# EAGLE design Board (EAGLE 6.1)
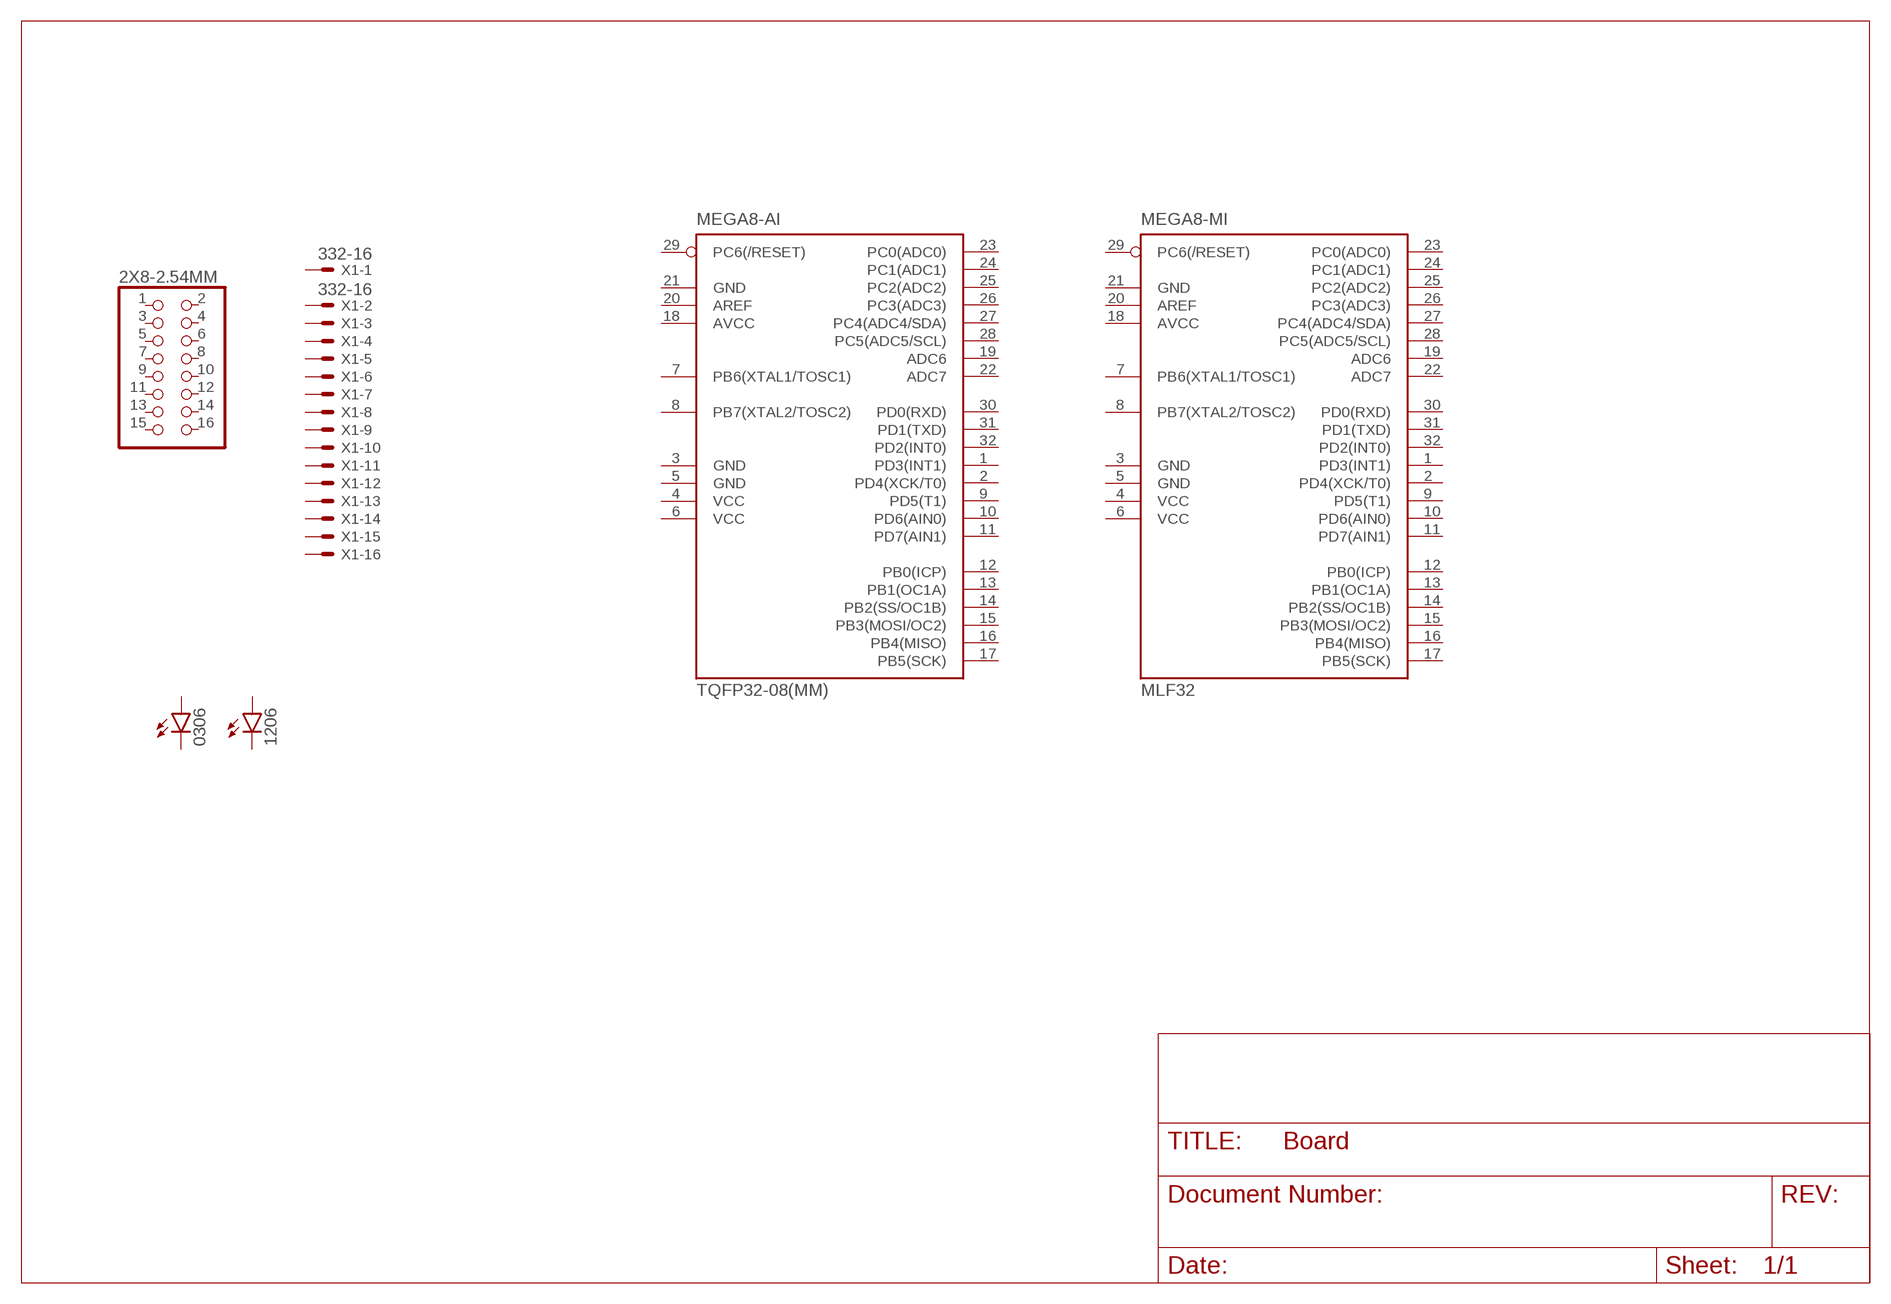
[diagram p0: schematic, sheet 1]

## Parts
2X8-2.54MM  PINHD-2X8  [2X08]
0306  LED0603  [LED-0603]
1206  LED1206  [LED-1206]
MLF32  MEGA8-MI  [MLF32]
TQFP32-08(MM)  MEGA8-AI  [TQFP32-08]
X1  332-16  [332-16]
Unconnected: 2X8-2.54MM.1 2X8-2.54MM.2 2X8-2.54MM.3 2X8-2.54MM.4 2X8-2.54MM.5 2X8-2.54MM.6 2X8-2.54MM.7 2X8-2.54MM.8 2X8-2.54MM.9 2X8-2.54MM.10 2X8-2.54MM.11 2X8-2.54MM.12 2X8-2.54MM.13 2X8-2.54MM.14 2X8-2.54MM.15 2X8-2.54MM.16 0306.A 0306.C 1206.A 1206.C MLF32.1(PD3(INT1)) MLF32.2(PD4(XCK/T0)) MLF32.7(PB6(XTAL1/TOSC1)) MLF32.8(PB7(XTAL2/TOSC2)) MLF32.9(PD5(T1)) MLF32.10(PD6(AIN0)) MLF32.11(PD7(AIN1)) MLF32.12(PB0(ICP)) MLF32.13(PB1(OC1A)) MLF32.14(PB2(SS/OC1B)) MLF32.15(PB3(MOSI/OC2)) MLF32.16(PB4(MISO)) MLF32.17(PB5(SCK)) MLF32.19(ADC6) MLF32.20(AREF) MLF32.22(ADC7) MLF32.23(PC0(ADC0)) MLF32.24(PC1(ADC1)) MLF32.25(PC2(ADC2)) MLF32.26(PC3(ADC3)) MLF32.27(PC4(ADC4/SDA)) MLF32.28(PC5(ADC5/SCL)) MLF32.29(PC6(/RESET)) MLF32.30(PD0(RXD)) MLF32.31(PD1(TXD)) MLF32.32(PD2(INT0)) TQFP32-08(MM).1(PD3(INT1)) TQFP32-08(MM).2(PD4(XCK/T0)) TQFP32-08(MM).7(PB6(XTAL1/TOSC1)) TQFP32-08(MM).8(PB7(XTAL2/TOSC2)) TQFP32-08(MM).9(PD5(T1)) TQFP32-08(MM).10(PD6(AIN0)) TQFP32-08(MM).11(PD7(AIN1)) TQFP32-08(MM).12(PB0(ICP)) TQFP32-08(MM).13(PB1(OC1A)) TQFP32-08(MM).14(PB2(SS/OC1B)) TQFP32-08(MM).15(PB3(MOSI/OC2)) TQFP32-08(MM).16(PB4(MISO)) TQFP32-08(MM).17(PB5(SCK)) TQFP32-08(MM).19(ADC6) TQFP32-08(MM).20(AREF) TQFP32-08(MM).22(ADC7) TQFP32-08(MM).23(PC0(ADC0)) TQFP32-08(MM).24(PC1(ADC1)) TQFP32-08(MM).25(PC2(ADC2)) TQFP32-08(MM).26(PC3(ADC3)) TQFP32-08(MM).27(PC4(ADC4/SDA)) TQFP32-08(MM).28(PC5(ADC5/SCL)) TQFP32-08(MM).29(PC6(/RESET)) TQFP32-08(MM).30(PD0(RXD)) TQFP32-08(MM).31(PD1(TXD)) TQFP32-08(MM).32(PD2(INT0)) X1.1 X1.2 X1.3 X1.4 X1.5 X1.6 X1.7 X1.8 X1.9 X1.10 X1.11 X1.12 X1.13 X1.14 X1.15 X1.16

## Power pins joined to a net without a drawn wire
AVCC: MLF32.18(AVCC) TQFP32-08(MM).18(AVCC)
GND: MLF32.3(GND) MLF32.5(GND) MLF32.21(GND) TQFP32-08(MM).3(GND) TQFP32-08(MM).5(GND) TQFP32-08(MM).21(GND)
VCC: MLF32.4(VCC) MLF32.6(VCC) TQFP32-08(MM).4(VCC) TQFP32-08(MM).6(VCC)

## Library data of the parts
2X8-2.54MM = pinhead:PINHD-2X8: PIN HEADER
0306 1206 = SparkFun-LED:LED: LEDs Standard schematic elements and footprints for 5mm, 3mm, 1206, and 0603 sized LEDs. 5mm - Spark Fun Electronics SKU : COM-00529 (and others)
MLF32 = atmel:MEGA8: MICROCONTROLLER 8 Kbytes FLASH, 1 kbytes SRAM, 512 bytes EEPROM, USART, 6-channel 10 bit ADC, 2-channel 8 bit ADC Pin compatible with Atmega48, ATMega88, ATMega168 Source: avr.lbr; MPN: ATMEGA88PA-MU; OC_FARNELL: 1715491; OC_NEWARK: 15R0272
TQFP32-08(MM) = atmel:MEGA8: MICROCONTROLLER 8 Kbytes FLASH, 1 kbytes SRAM, 512 bytes EEPROM, USART, 6-channel 10 bit ADC, 2-channel 8 bit ADC Pin compatible with Atmega48, ATMega88, ATMega168 Source: avr.lbr; MPN: ATMEGA8-16AU; OC_FARNELL: 9171371; OC_NEWARK: 73M8863
X1 = con-garry:332-16: 16 Pin - 2mm Dual Row Source: www.mpe-connector.de / garry_shortform_2012.pdf

## Board
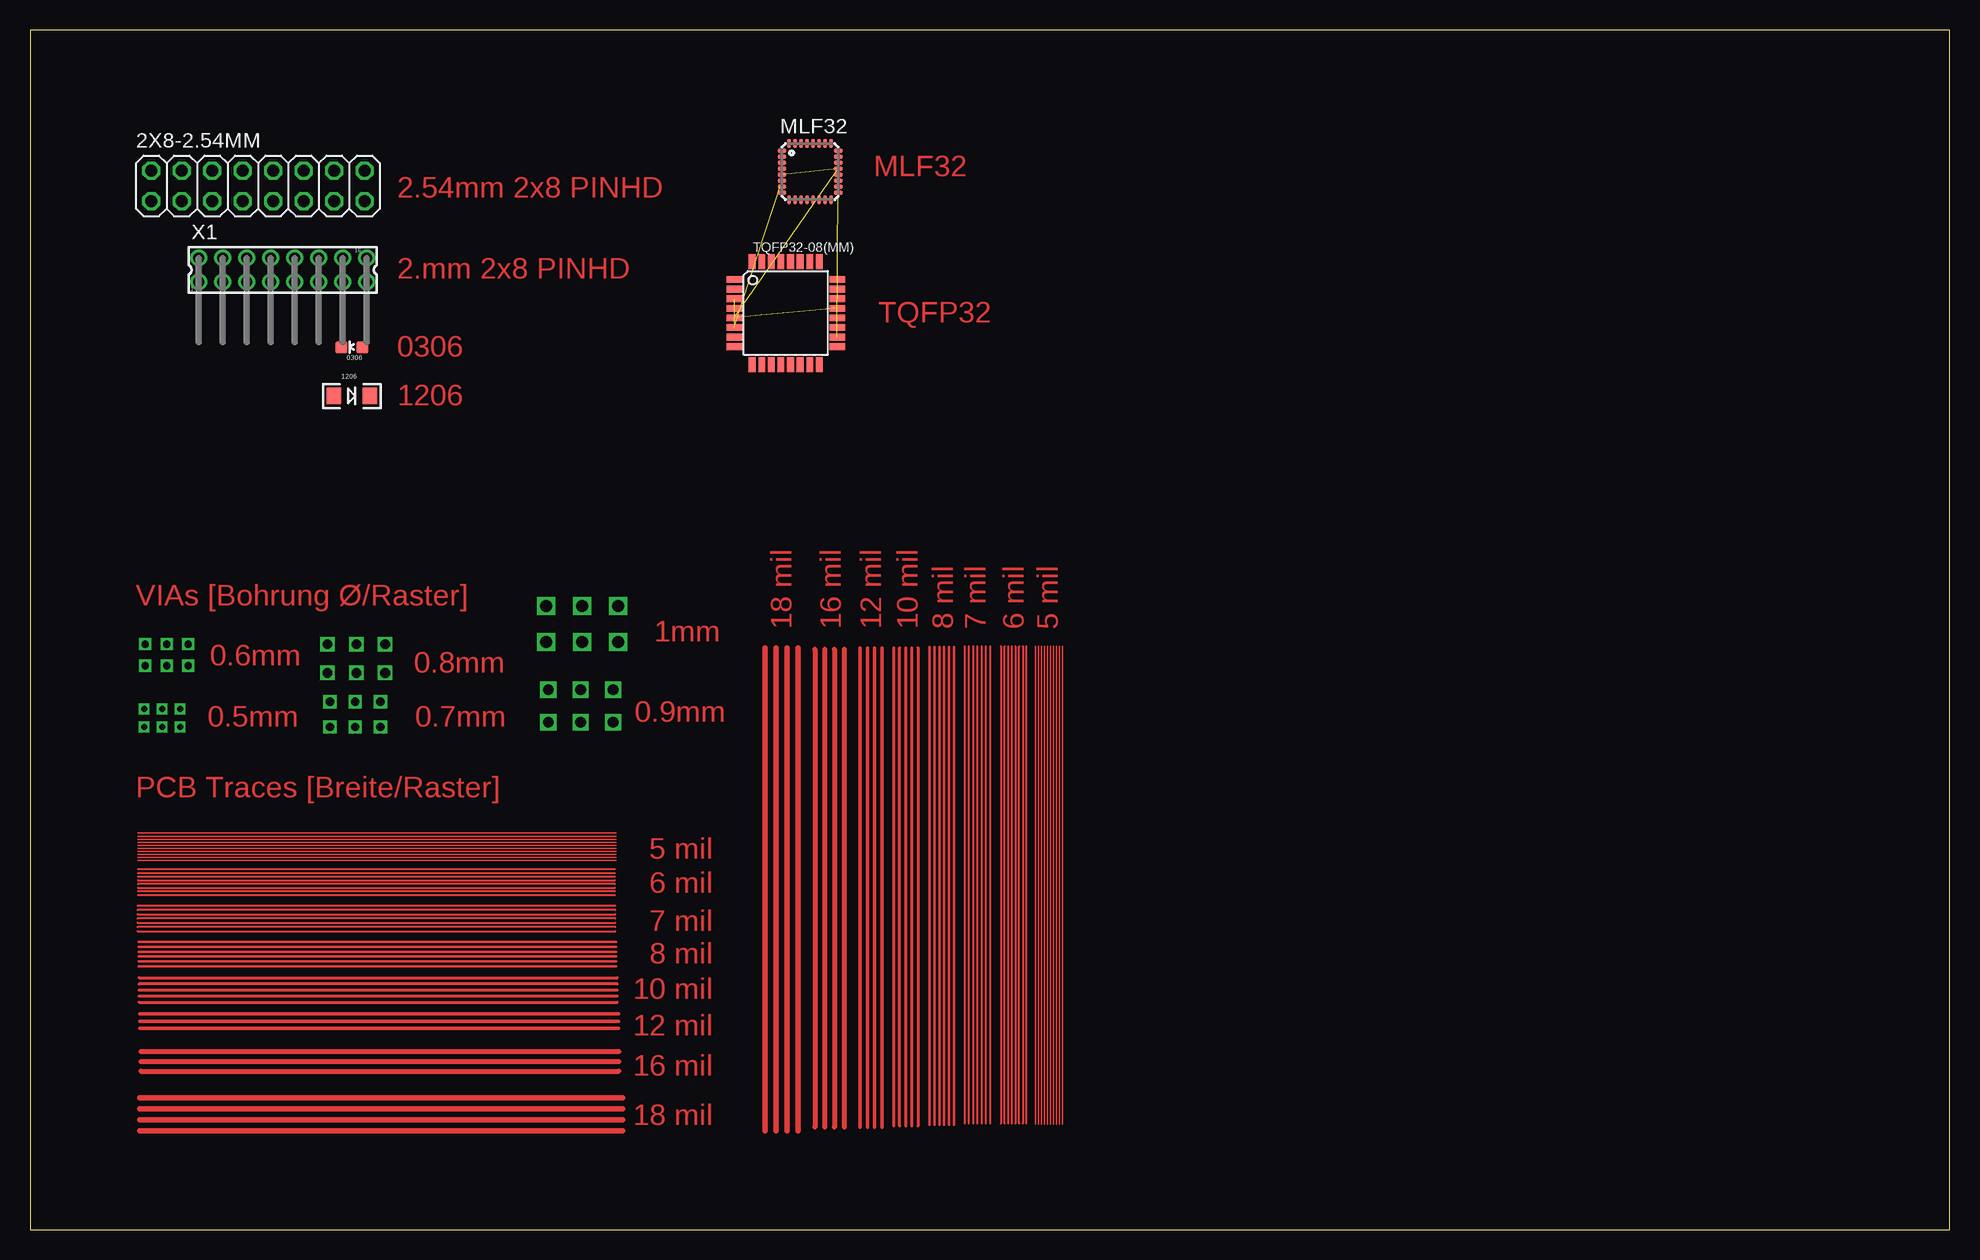
[diagram p1: board, top side]

Size 160 x 100 mm. Coordinates in mm from the lower left corner, seen from the top.
Outline: 0,0 160,0 160,100 0,100 0,0
Copper layers (1*16): Top 0.035mm / dielectric 1.5mm / Bottom 0.035mm
Design rules: minimum track width 10mil, minimum drill 24mil, track to track 8mil, track to pad 8mil, pad to pad 8mil, via to via 8mil, smd to smd 8mil, copper to edge 40mil, drill to drill 8mil, minimum pad ring 10mil, minimum via ring 8mil, stop-mask expansion 4mil, vias tented up to drill 0mil, thermal gap 10mil

### Footprints (pad centres in the part's own frame; a part is rotated, then mirrored left to right if it is on the bottom)
2X08 = drill 1.016 octagon: 1 -8.89,-1.27; 2 -8.89,1.27; 3 -6.35,-1.27; 4 -6.35,1.27; 5 -3.81,-1.27; 6 -3.81,1.27; 7 -1.27,-1.27; 8 -1.27,1.27; 9 1.27,-1.27; 10 1.27,1.27; 11 3.81,-1.27; 12 3.81,1.27; 13 6.35,-1.27; 14 6.35,1.27; 15 8.89,-1.27; 16 8.89,1.27
LED-0603 = smd 1 x 1: A 0,-0.877; C 0,0.877
LED-1206 = smd 1.2 x 1.4: A -1.5,0; C 1.5,0
MLF32 = smd 0.7 x 0.3: 1 -2.35,1.75; 2 -2.35,1.25; 3 -2.35,0.75; 4 -2.35,0.25; 5 -2.35,-0.25; 6 -2.35,-0.75; 7 -2.35,-1.25; 8 -2.35,-1.75; 17 2.35,-1.75; 18 2.35,-1.25; 19 2.35,-0.75; 20 2.35,-0.25; 21 2.35,0.25; 22 2.35,0.75; 23 2.35,1.25; 24 2.35,1.75 | smd 0.3 x 0.7: 9 -1.75,-2.35; 10 -1.25,-2.35; 11 -0.75,-2.35; 12 -0.25,-2.35; 13 0.25,-2.35; 14 0.75,-2.35; 15 1.25,-2.35; 16 1.75,-2.35; 25 1.75,2.35; 26 1.25,2.35; 27 0.75,2.35; 28 0.25,2.35; 29 -0.25,2.35; 30 -0.75,2.35; 31 -1.25,2.35; 32 -1.75,2.35
TQFP32-08 = smd 1.27 x 0.559: 1 -4.293,2.8; 2 -4.293,2; 3 -4.293,1.2; 4 -4.293,0.4; 5 -4.293,-0.4; 6 -4.293,-1.2; 7 -4.293,-2; 8 -4.293,-2.8; 17 4.293,-2.8; 18 4.293,-2; 19 4.293,-1.2; 20 4.293,-0.4; 21 4.293,0.4; 22 4.293,1.2; 23 4.293,2; 24 4.293,2.8 | smd 0.559 x 1.27: 9 -2.8,-4.293; 10 -2,-4.293; 11 -1.2,-4.293; 12 -0.4,-4.293; 13 0.4,-4.293; 14 1.2,-4.293; 15 2,-4.293; 16 2.8,-4.293; 25 2.8,4.293; 26 2,4.293; 27 1.2,4.293; 28 0.4,4.293; 29 -0.4,4.293; 30 -1.2,4.293; 31 -2,4.293; 32 -2.8,4.293
332-16 = drill 0.9 pad 1.27: 1 -7,-1; 2 -7,1; 3 -5,-1; 4 -5,1; 5 -3,-1; 6 -3,1; 7 -1,-1; 8 -1,1; 9 1,-1; 10 1,1; 11 3,-1; 12 3,1; 13 5,-1; 14 5,1; 15 7,-1; 16 7,1

### Placement (x,y rotation side)
2X8-2.54MM  19,87 0 top
0306  26.82,73.56 90 top
1206  26.82,69.49 0 top
MLF32  65.02,88.19 0 top
TQFP32-08(MM)  62.99,76.4 0 top
X1  21.06,80 0 top

### Tracks (layer width: path | path; a pad name or v marks a point on that pad's centre or on a via)
AVCC  (1 unrouted)
GND  (5 unrouted)
N$3
  Top 0.406: 9.25,13.21 49.07,13.21
N$4
  Top 0.406: 9.25,14.02 49.07,14.02
N$5
  Top 0.406: 9.25,14.83 49.07,14.83
N$6
  Top 0.305: 49.07,16.76 9.14,16.76
N$7
  Top 0.305: 9.14,17.37 49.07,17.37
N$8
  Top 0.305: 49.07,17.98 9.14,17.98
N$9
  Top 0.254: 9.09,18.95 48.97,18.95
N$10
  Top 0.254: 48.97,19.46 9.09,19.46
N$11
  Top 0.254: 9.09,19.96 48.97,19.96
N$12
  Top 0.254: 48.97,20.47 9.09,20.47
N$13
  Top 0.254: 9.09,20.98 48.97,20.98
N$14
  Top 0.203: 9.04,21.95 48.87,21.95
N$15
  Top 0.203: 48.87,22.35 9.04,22.35
N$16
  Top 0.203: 9.04,22.76 48.87,22.76
N$17
  Top 0.203: 48.87,23.16 9.04,23.16
N$18
  Top 0.203: 9.04,23.57 48.87,23.57
N$19
  Top 0.203: 48.87,23.98 9.04,23.98
N$20
  Top 0.178: 8.97,24.87 48.79,24.87
N$21
  Top 0.178: 48.79,25.22 8.97,25.22
N$22
  Top 0.178: 8.97,25.58 48.79,25.58
N$23
  Top 0.178: 48.79,25.93 8.97,25.93
N$24
  Top 0.178: 8.97,26.29 48.79,26.29
N$25
  Top 0.178: 48.79,26.64 8.97,26.64
N$26
  Top 0.178: 8.97,27 48.79,27
N$27
  Top 0.152: 8.99,27.89 48.77,27.89
N$28
  Top 0.152: 48.77,28.19 8.99,28.19
N$29
  Top 0.152: 8.99,28.5 48.77,28.5
N$30
  Top 0.152: 48.77,28.8 8.99,28.8
N$31
  Top 0.152: 8.99,29.11 48.77,29.11
N$32
  Top 0.152: 48.77,29.41 8.99,29.41
N$33
  Top 0.152: 8.99,29.72 48.77,29.72
N$34
  Top 0.152: 48.77,30.02 8.99,30.02
N$35
  Top 0.127: 8.97,30.76 48.84,30.76
N$36
  Top 0.127: 48.84,31.01 8.97,31.01
N$37
  Top 0.127: 8.97,31.27 48.84,31.27
N$38
  Top 0.127: 8.97,31.52 48.84,31.52
N$39
  Top 0.127: 48.84,31.77 8.97,31.77
N$40
  Top 0.127: 8.97,32.03 48.84,32.03
N$41
  Top 0.127: 48.84,32.28 8.97,32.28
N$42
  Top 0.127: 8.97,32.54 48.84,32.54
N$43
  Top 0.127: 48.84,32.79 8.97,32.79
N$44
  Top 0.127: 8.97,33.05 48.84,33.05
N$45
  Top 0.457: 9.14,10.97 49.38,10.97
N$46
  Top 0.457: 49.38,10.06 9.14,10.06
N$47
  Top 0.457: 9.14,9.14 49.38,9.14
N$48
  Top 0.457: 49.38,8.23 9.14,8.23
N$49
  Top 0.406: 65.43,48.36 65.43,8.53
N$50
  Top 0.406: 66.24,48.36 66.24,8.53
N$51
  Top 0.406: 67.06,48.36 67.06,8.53
N$52
  Top 0.406: 67.87,48.36 67.87,8.53
N$53
  Top 0.305: 69.19,48.46 69.19,8.53
N$54
  Top 0.305: 69.8,8.53 69.8,48.46
N$55
  Top 0.305: 70.41,48.46 70.41,8.53
N$56
  Top 0.305: 71.02,8.53 71.02,48.46
N$57
  Top 0.254: 71.98,48.51 71.98,8.64
N$58
  Top 0.254: 72.49,8.64 72.49,48.51
N$59
  Top 0.254: 73,48.51 73,8.64
N$60
  Top 0.254: 73.51,8.64 73.51,48.51
N$61
  Top 0.254: 74.02,48.51 74.02,8.64
N$62
  Top 0.203: 74.98,48.56 74.98,8.74
N$63
  Top 0.203: 75.39,8.74 75.39,48.56
N$64
  Top 0.203: 75.79,48.56 75.79,8.74
N$65
  Top 0.203: 76.2,8.74 76.2,48.56
N$66
  Top 0.203: 76.61,48.56 76.61,8.74
N$67
  Top 0.203: 77.01,8.74 77.01,48.56
N$68
  Top 0.178: 77.9,48.64 77.9,8.81
N$69
  Top 0.178: 78.26,8.81 78.26,48.64
N$70
  Top 0.178: 78.61,48.64 78.61,8.81
N$71
  Top 0.178: 78.97,8.81 78.97,48.64
N$72
  Top 0.178: 79.32,48.64 79.32,8.81
N$73
  Top 0.178: 79.68,8.81 79.68,48.64
N$74
  Top 0.178: 80.03,48.64 80.03,8.81
N$75
  Top 0.152: 80.92,48.62 80.92,8.84
N$76
  Top 0.152: 81.23,8.84 81.23,48.62
N$77
  Top 0.152: 81.53,48.62 81.53,8.84
N$78
  Top 0.152: 81.84,8.84 81.84,48.62
N$79
  Top 0.152: 82.14,48.62 82.14,8.84
N$80
  Top 0.152: 82.45,8.84 82.45,48.62
N$81
  Top 0.152: 82.75,48.62 82.75,8.84
N$82
  Top 0.152: 83.06,8.84 83.06,48.62
N$83
  Top 0.127: 83.8,48.64 83.8,8.76
N$84
  Top 0.127: 84.05,8.76 84.05,48.64
N$85
  Top 0.127: 84.3,48.64 84.3,8.76
N$86
  Top 0.127: 84.56,48.64 84.56,8.76
N$87
  Top 0.127: 84.81,8.76 84.81,48.64
N$88
  Top 0.127: 85.06,48.64 85.06,8.76
N$89
  Top 0.127: 85.32,8.76 85.32,48.64
N$90
  Top 0.127: 85.57,48.64 85.57,8.76
N$91
  Top 0.127: 85.83,8.76 85.83,48.64
N$92
  Top 0.127: 86.08,48.64 86.08,8.76
N$93
  Top 0.457: 64.01,48.46 64.01,8.23
N$94
  Top 0.457: 63.09,8.23 63.09,48.46
N$95
  Top 0.457: 62.18,48.46 62.18,8.23
N$96
  Top 0.457: 61.27,8.23 61.27,48.46
N$97  (via drill 0.5)
  other vias: 9.5,41.9
N$98  (via drill 0.5)
  other vias: 11,41.9
N$99  (via drill 0.5)
  other vias: 12.5,41.9
N$100  (via drill 0.5)
  other vias: 9.5,43.4
N$101  (via drill 0.5)
  other vias: 11,43.4
N$102  (via drill 0.5)
  other vias: 12.5,43.4
N$103  (via drill 0.6)
  other vias: 9.6,47
N$104  (via drill 0.6)
  other vias: 11.4,47
N$105  (via drill 0.6)
  other vias: 13.2,47
N$106  (via drill 0.6)
  other vias: 9.6,48.8
N$107  (via drill 0.6)
  other vias: 11.4,48.8
N$108  (via drill 0.6)
  other vias: 13.2,48.8
N$109  (via drill 0.7)
  other vias: 25,41.9
N$110  (via drill 0.7)
  other vias: 27.1,41.9
N$111  (via drill 0.7)
  other vias: 29.2,41.9
N$112  (via drill 0.7)
  other vias: 29.2,44
N$113  (via drill 0.7)
  other vias: 27.1,44
N$114  (via drill 0.7)
  other vias: 25,44
N$115  (via drill 0.8)
  other vias: 24.8,46.4
N$116  (via drill 0.8)
  other vias: 27.2,46.4
N$117  (via drill 0.8)
  other vias: 29.6,46.4
N$118  (via drill 0.8)
  other vias: 29.6,48.8
N$119  (via drill 0.8)
  other vias: 27.2,48.8
N$120  (via drill 0.8)
  other vias: 24.8,48.8
N$121  (via drill 0.9)
  other vias: 43.2,42.3
N$122  (via drill 0.9)
  other vias: 45.9,42.3
N$123  (via drill 0.9)
  other vias: 48.6,42.3
N$124  (via drill 0.9)
  other vias: 43.2,45
N$125  (via drill 0.9)
  other vias: 45.9,45
N$126  (via drill 0.9)
  other vias: 48.6,45
N$127  (via drill 1)
  other vias: 43,49
N$128  (via drill 1)
  other vias: 46,49
N$129  (via drill 1)
  other vias: 49,49
N$130  (via drill 1)
  other vias: 49,52
N$131  (via drill 1)
  other vias: 46,52
N$132  (via drill 1)
  other vias: 43,52
VCC  (3 unrouted)

### Text on the board
Top: MLF32 | 2.54mm 2x8 PINHD | 2.mm 2x8 PINHD | TQFP32 | 0306 | 1206 | VIAs [Bohrung Ø/Raster] | 18 mil | 16 mil | 12 mil | 10 mil | 8 mil | 7 mil | 6 mil | 5 mil | 1mm | 0.6mm | 0.8mm | 0.5mm | 0.7mm | 0.9mm | PCB Traces [Breite/Raster] | 5 mil | 6 mil | 7 mil | 8 mil | 10 mil | 12 mil | 16 mil | 18 mil